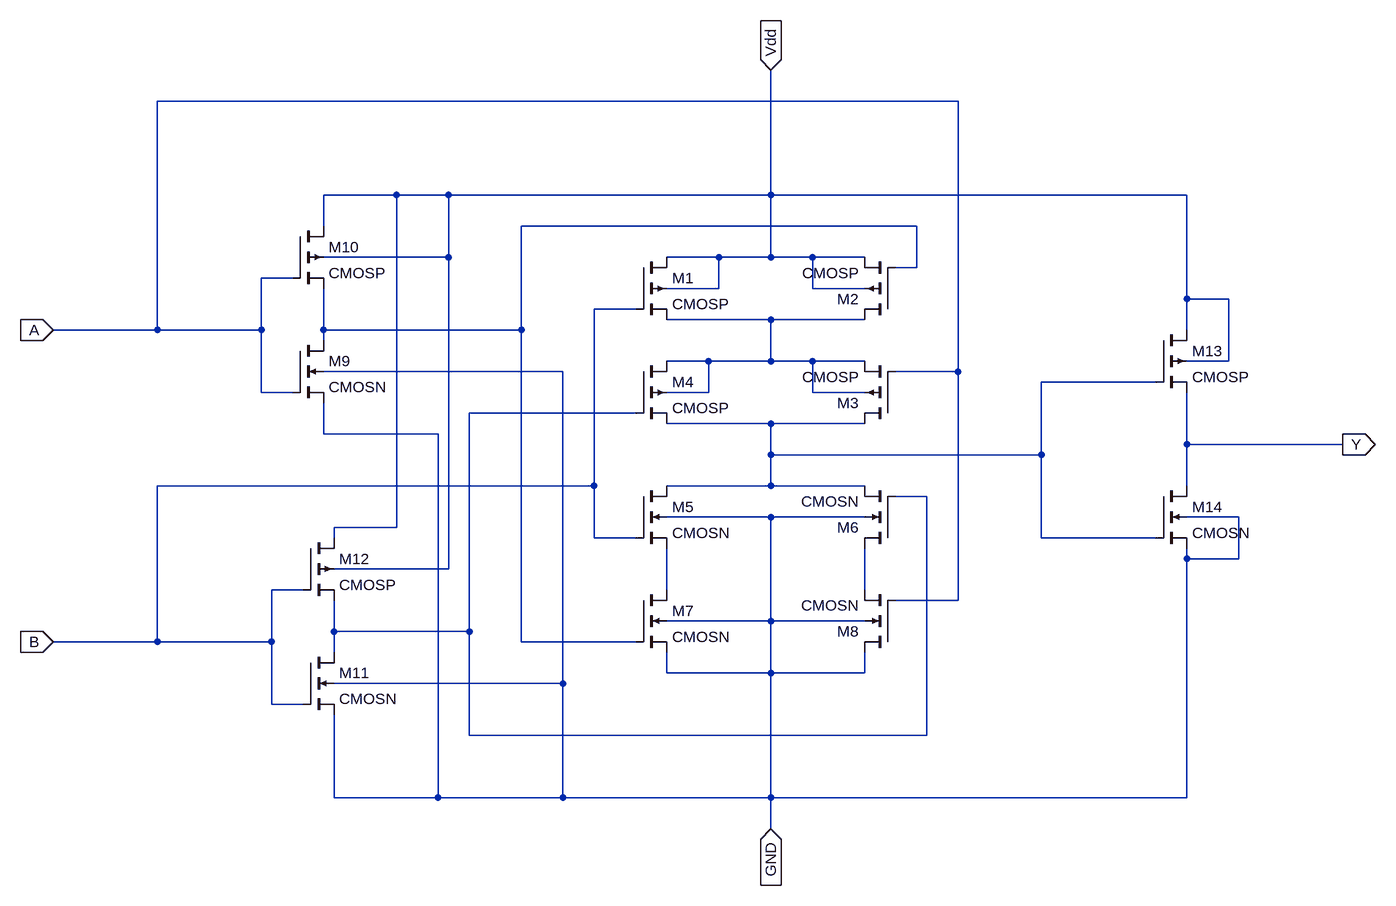
[diagram p0: schematic xor_cmos.asc]
xor_cmos.asc, the LTspice schematic file:
Version 4
SHEET 1 1420 1136
WIRE 752 -96 -480 -96
WIRE -112 48 -224 48
WIRE -32 48 -112 48
WIRE 464 48 464 -144
WIRE 464 48 -32 48
WIRE 1104 48 464 48
WIRE -224 96 -224 48
WIRE 688 96 80 96
WIRE -32 144 -32 48
WIRE -32 144 -224 144
WIRE 384 144 304 144
WIRE 464 144 464 48
WIRE 464 144 384 144
WIRE 528 144 464 144
WIRE 608 144 528 144
WIRE 688 160 688 96
WIRE 688 160 656 160
WIRE -272 176 -320 176
WIRE 384 192 384 144
WIRE 384 192 304 192
WIRE 528 192 528 144
WIRE 608 192 528 192
WIRE 1104 208 1104 48
WIRE 1168 208 1104 208
WIRE 256 224 192 224
WIRE 464 240 304 240
WIRE 608 240 464 240
WIRE -480 256 -480 -96
WIRE -480 256 -640 256
WIRE -320 256 -320 176
WIRE -320 256 -480 256
WIRE -224 256 -224 192
WIRE 80 256 80 96
WIRE 80 256 -224 256
WIRE 1104 256 1104 208
WIRE -224 272 -224 256
WIRE 368 304 304 304
WIRE 464 304 464 240
WIRE 464 304 368 304
WIRE 528 304 464 304
WIRE 608 304 528 304
WIRE 1168 304 1168 208
WIRE 1168 304 1104 304
WIRE 144 320 -224 320
WIRE 752 320 752 -96
WIRE 752 320 656 320
WIRE 1056 336 880 336
WIRE -320 352 -320 256
WIRE -272 352 -320 352
WIRE 368 352 368 304
WIRE 368 352 304 352
WIRE 528 352 528 304
WIRE 608 352 528 352
WIRE 256 384 0 384
WIRE 464 400 304 400
WIRE 608 400 464 400
WIRE -224 416 -224 368
WIRE -48 416 -224 416
WIRE 1104 432 1104 352
WIRE 1344 432 1104 432
WIRE 464 448 464 400
WIRE 880 448 880 336
WIRE 880 448 464 448
WIRE 192 496 192 224
WIRE 192 496 -480 496
WIRE 464 496 464 448
WIRE 464 496 304 496
WIRE 608 496 464 496
WIRE 1104 496 1104 432
WIRE 704 512 656 512
WIRE 464 544 304 544
WIRE 608 544 464 544
WIRE 1184 544 1104 544
WIRE -112 560 -112 48
WIRE -112 560 -208 560
WIRE -208 576 -208 560
WIRE 192 576 192 496
WIRE 256 576 192 576
WIRE 880 576 880 448
WIRE 1056 576 880 576
WIRE 1104 608 1104 592
WIRE 1184 608 1184 544
WIRE 1184 608 1104 608
WIRE -32 624 -32 144
WIRE -32 624 -208 624
WIRE -256 656 -304 656
WIRE 304 656 304 592
WIRE 608 656 608 592
WIRE 752 672 752 320
WIRE 752 672 656 672
WIRE 464 704 464 544
WIRE 464 704 304 704
WIRE 608 704 464 704
WIRE -208 720 -208 672
WIRE 0 720 0 384
WIRE 0 720 -208 720
WIRE -480 736 -480 496
WIRE -480 736 -640 736
WIRE -304 736 -304 656
WIRE -304 736 -480 736
WIRE 80 736 80 256
WIRE 256 736 80 736
WIRE -208 752 -208 720
WIRE 304 784 304 752
WIRE 464 784 464 704
WIRE 464 784 304 784
WIRE 608 784 608 752
WIRE 608 784 464 784
WIRE 144 800 144 320
WIRE 144 800 -208 800
WIRE -304 832 -304 736
WIRE -256 832 -304 832
WIRE 0 880 0 720
WIRE 704 880 704 512
WIRE 704 880 0 880
WIRE -208 976 -208 848
WIRE -48 976 -48 416
WIRE -48 976 -208 976
WIRE 144 976 144 800
WIRE 144 976 -48 976
WIRE 464 976 464 784
WIRE 464 976 144 976
WIRE 1104 976 1104 608
WIRE 1104 976 464 976
WIRE 464 1024 464 976
FLAG -640 256 A
IOPIN -640 256 In
FLAG -640 736 B
IOPIN -640 736 In
FLAG 1344 432 Y
IOPIN 1344 432 Out
FLAG 464 -144 Vdd
IOPIN 464 -144 In
FLAG 464 1024 GND
IOPIN 464 1024 In
SYMBOL cmosp 256 144 R0
SYMATTR InstName M1
SYMATTR Value2 l=180n w=1u
SYMBOL cmosp 656 240 R180
SYMATTR InstName M2
SYMATTR Value2 l=180n w=1u
SYMBOL cmosp 656 400 R180
SYMATTR InstName M3
SYMATTR Value2 l=180n w=1u
SYMBOL cmosp 256 304 R0
SYMATTR InstName M4
SYMATTR Value2 l=180n w=1u
SYMBOL cmosn 256 496 R0
SYMATTR InstName M5
SYMATTR Value2 l=180n w=1u
SYMBOL cmosn 656 592 R180
SYMATTR InstName M6
SYMATTR Value2 l=180n w=1u
SYMBOL cmosn 256 656 R0
SYMATTR InstName M7
SYMATTR Value2 l=180n w=1u
SYMBOL cmosn 656 752 R180
SYMATTR InstName M8
SYMATTR Value2 l=180n w=1u
SYMBOL cmosn -272 272 R0
SYMATTR InstName M9
SYMATTR Value2 l=180n w=1u
SYMBOL cmosp -272 96 R0
SYMATTR InstName M10
SYMATTR Value2 l=180n w=1u
SYMBOL cmosn -256 752 R0
SYMATTR InstName M11
SYMATTR Value2 l=180n w=1u
SYMBOL cmosp -256 576 R0
SYMATTR InstName M12
SYMATTR Value2 l=180n w=1u
SYMBOL cmosp 1056 256 R0
SYMATTR InstName M13
SYMATTR Value2 l=180n w=1u
SYMBOL cmosn 1056 496 R0
SYMATTR InstName M14
SYMATTR Value2 l=180n w=1u

The netlist it stands for:
* xor_cmos.asc
M1 Vdd B N002 Vdd CMOSP l=180n w=1u
M2 N002 N001 Vdd Vdd CMOSP l=180n w=1u
M3 N003 A N002 N002 CMOSP l=180n w=1u
M4 N002 N004 N003 N002 CMOSP l=180n w=1u
M5 N003 B N005 GND CMOSN l=180n w=1u
M6 N006 N004 N003 GND CMOSN l=180n w=1u
M7 N005 N001 GND GND CMOSN l=180n w=1u
M8 GND A N006 GND CMOSN l=180n w=1u
M9 N001 A GND GND CMOSN l=180n w=1u
M10 Vdd A N001 Vdd CMOSP l=180n w=1u
M11 N004 B GND GND CMOSN l=180n w=1u
M12 Vdd B N004 Vdd CMOSP l=180n w=1u
M13 Vdd N003 Y Vdd CMOSP l=180n w=1u
M14 Y N003 GND GND CMOSN l=180n w=1u
.model NMOS NMOS
.model PMOS PMOS
.lib standard.mos
.backanno
.end